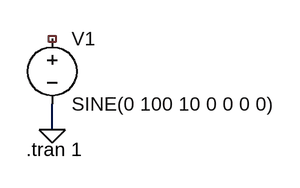
[diagram p0: schematic aula02.asc]
aula02.asc, the LTspice schematic file:
Version 4
SHEET 1 880 680
WIRE 112 176 112 144
FLAG 112 176 0
SYMBOL voltage 112 48 R0
WINDOW 123 0 0 Left 0
WINDOW 39 0 0 Left 0
SYMATTR InstName V1
SYMATTR Value SINE(0 100 10 0 0 0 0)
TEXT 80 200 Left 2 !.tran 1

The netlist it stands for:
* aula02.asc
V1 NC_01 0 SINE(0 100 10 0 0 0 0)
.tran 1
.backanno
.end